# EAGLE design InventHQ-LED-V1 (EAGLE 9.6.2)
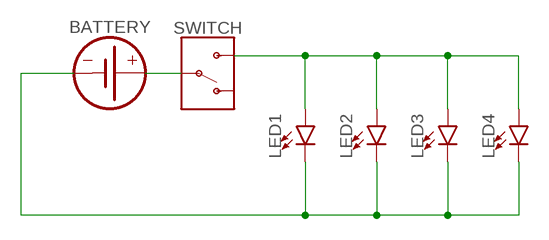
[diagram p0: schematic, sheet 1]

## Parts
BATTERY  COIN_CELL_HOLDER_BH-25C-1  [BH-25C-1]
LED1  LED_5MM_MIKE  [LED_5MM_MIKE]
LED2  LED_5MM_MIKE  [LED_5MM_MIKE]
LED3  LED_5MM_MIKE  [LED_5MM_MIKE]
LED4  LED_5MM_MIKE  [LED_5MM_MIKE]
SWITCH  SWITCH-SPDT-PTH-11.6X4.0MM-KIT  [SWITCH_SPDT_PTH_11.6X4.0MM_KIT]

## Nets
N$1: BATTERY.POS(+) SWITCH.2(P)
N$2: LED1.A LED2.A LED3.A LED4.A SWITCH.3(S)
N$3: BATTERY.NEG(-) LED1.K(C) LED2.K(C) LED3.K(C) LED4.K(C)
Unconnected: SWITCH.1(O)

## Library data of the parts
BATTERY = Mike-Temp:COIN_CELL_HOLDER
LED1-LED4 = Mike-Temp:LED: LED (Generic) Standard schematic elements and footprints for 5mm, 3mm, 1206, and 0603 sized LEDs. Generic LEDs with no color specified.
SWITCH = SparkFun-Switches:SWITCH-SPDT: Single Pole, Double Throw (SPDT) Switch Single-pole, double-throw (SPDT) switch. Variant Overview SMD-AYZ0202 Surface Mount DPDT Switch <https://www.sparkfun.com/products/597> (COM-00597) Used on e.g. LilyPad Arduino USB - ATmega32U4 Board <https://www.sparkfun.com/products/12049> PTH-11.6X4.0MM SPDT Mini Power Switch <https://www.sparkfun.com/products/102> (COM-00102) Used on e.g. SparkFun Simon Says - Through-Hole Soldering Kit <https://www.sparkfun.com/products/10547> (KIT-10547) PTH-11.6X4.0MM-KIT KIT version of SPDT Mini Power Switch - Simplifies soldering by removing tStop of switch pins - only one side can be soldered. PTH-11.6X4.0MM-LOCK LOCK version of SPDT Mini Power Switch - Offset pins hold switch in place for easier soldering. SMD-RIGHT-ANGLE Surface Mount Right Angle Switch <https://www.sparkfun.com/products/10860> (COM-10860) Used on e.g. SparkFun ESP8266 Thing <https://www.sparkfun.com/products/13231>; PROD_ID: SWCH-08261; SF_SKU: COM-00102

## Board
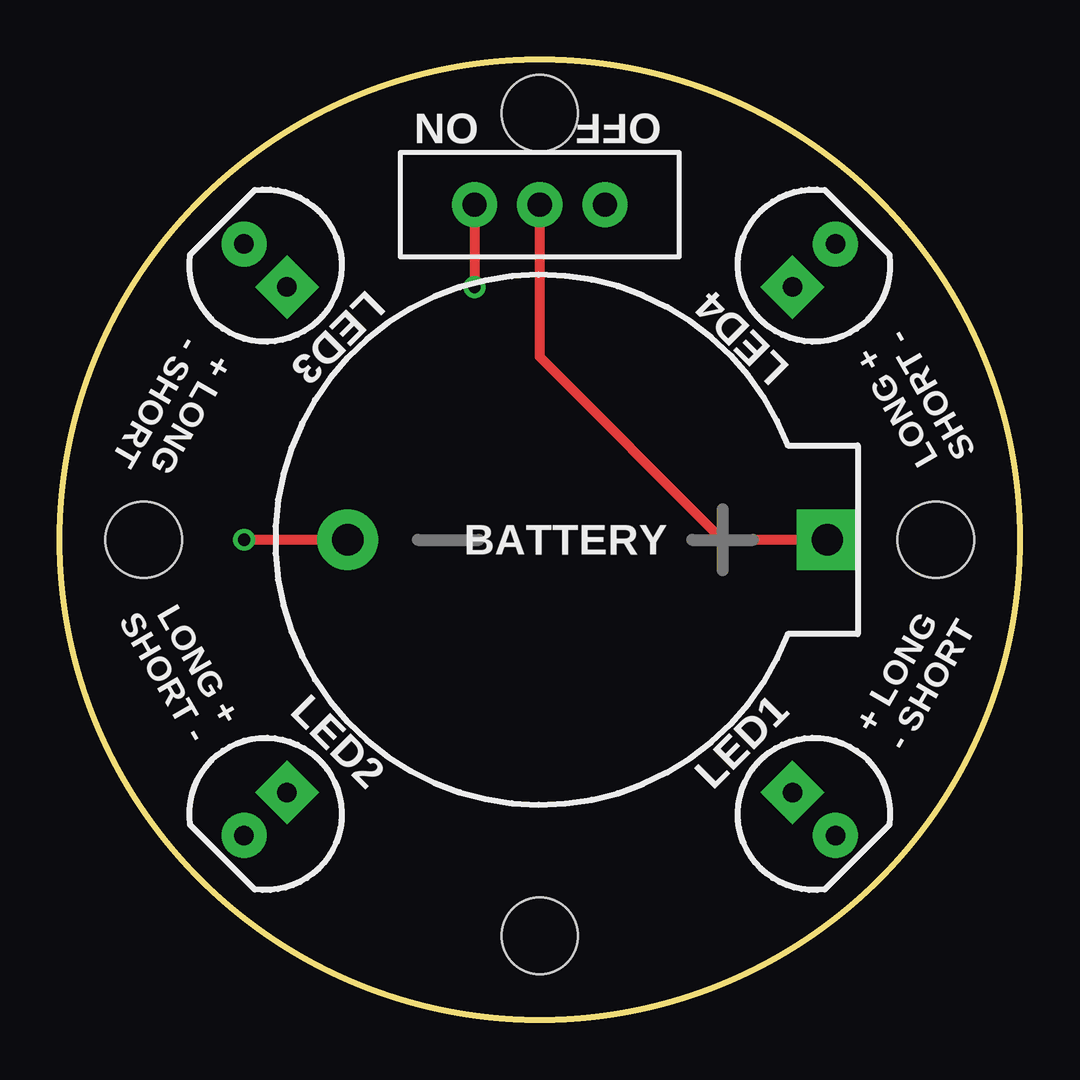
[diagram p1: board, top side]
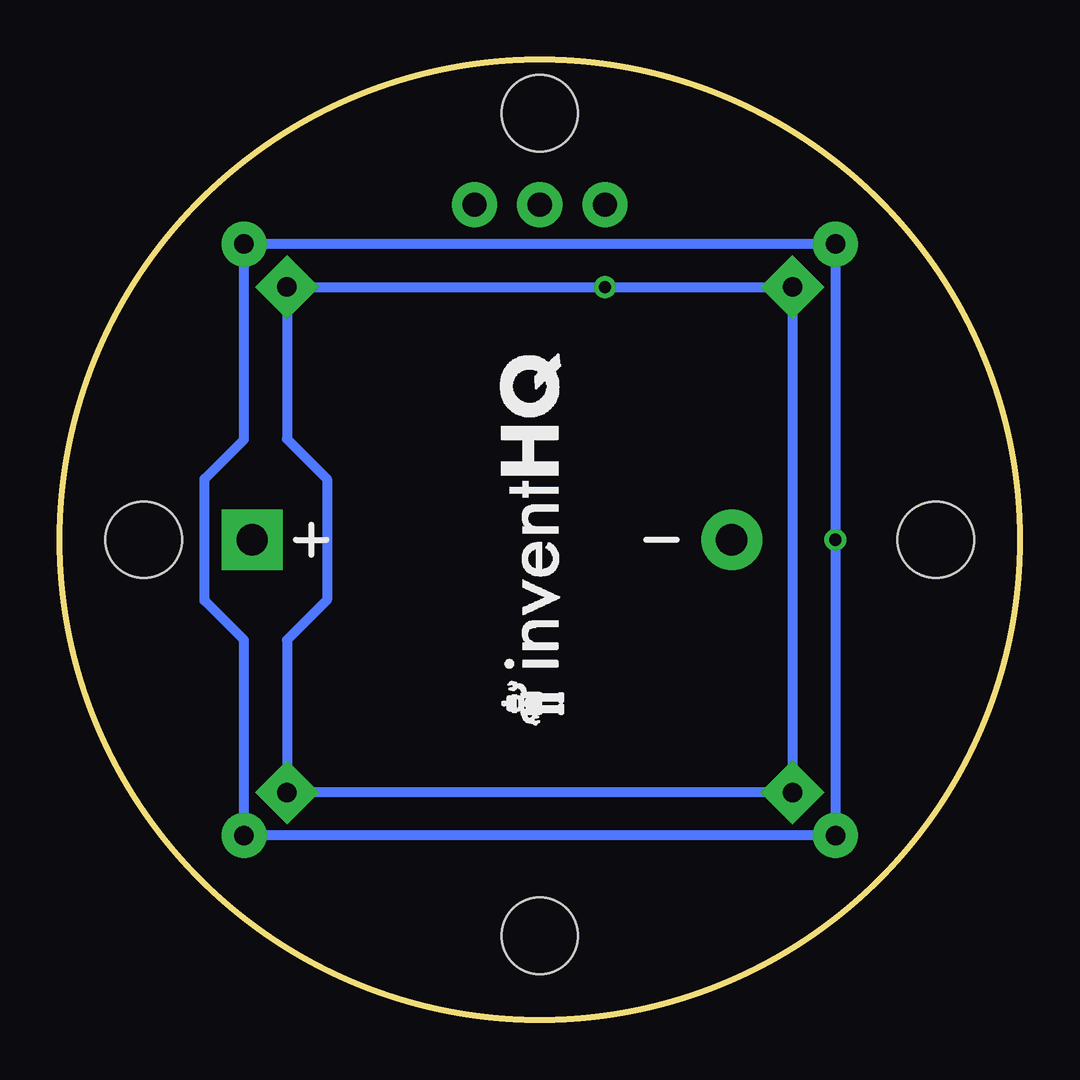
[diagram p2: board, bottom side, seen from below]

Size 40 x 40 mm. Coordinates in mm from the lower left corner, seen from the top.
Outline: circle at 20,20 radius 20
Copper layers (1*16): Top 0.035mm / dielectric 1.5mm / Bottom 0.035mm
Design rules "Mike 2-layer-TIGHT": minimum track width 6mil, minimum drill 0.35mm, track to track 6mil, track to pad 6mil, pad to pad 6mil, via to via 6mil, smd to smd 6mil, copper to edge 10mil, drill to drill 6mil, minimum pad ring 10mil, minimum via ring 8mil, stop-mask expansion 4mil, vias tented up to drill 21mil, thermal gap 10mil
Holes 3.17 mm at 20,37.78 3.49,20 20,3.49 36.51,20

### Footprints (pad centres in the part's own frame; a part is rotated, then mirrored left to right if it is on the bottom)
BH-25C-1 = drill 1.295 pad 2.54: NEG -8.001,0 | drill 1.295 pad 2.54 square: POS 11.989,0
LED_5MM_MIKE = drill 0.813 pad 1.88 square: A -1.27,0 | drill 0.813 pad 1.88: K 1.27,0
SWITCH_SPDT_PTH_11.6X4.0MM_KIT = drill 1.016 pad 1.88: 1 0,2.718; 2 0,0; 3 0,-2.718

### Placement (x,y rotation side)
BATTERY  20,20 0 top
LED1  31.43,8.57 315 top
LED2  8.57,8.57 225 top
LED3  8.57,31.43 135 top
LED4  31.43,31.43 45 top
SWITCH  20,33.97 270 top

### Tracks (layer width: path | path; a pad name or v marks a point on that pad's centre or on a via)
N$1
  Top 0.406: BATTERY.POS 27.62,20 20,27.62 SWITCH.2
N$2  (via drill 0.51)
  Top 0.406: SWITCH.3 v17.28,30.53
  Bottom 0.406: LED3.A LED2.A LED1.A 30.53,15.82 28.87,17.48 28.87,22.54 30.53,24.21 LED4.A v17.28,30.53 LED3.A
N$3  (via drill 0.51)
  Top 0.406: BATTERY.NEG v7.67,20
  Bottom 0.406: LED3.K v7.67,20 LED2.K LED1.K 32.33,15.82 33.97,17.46 33.97,22.54 32.33,24.18 LED4.K LED3.K

### Text on the board
tPlace: ON | OFF | + LONG / - SHORT | LONG + / SHORT - | LONG + / SHORT - | + LONG / - SHORT